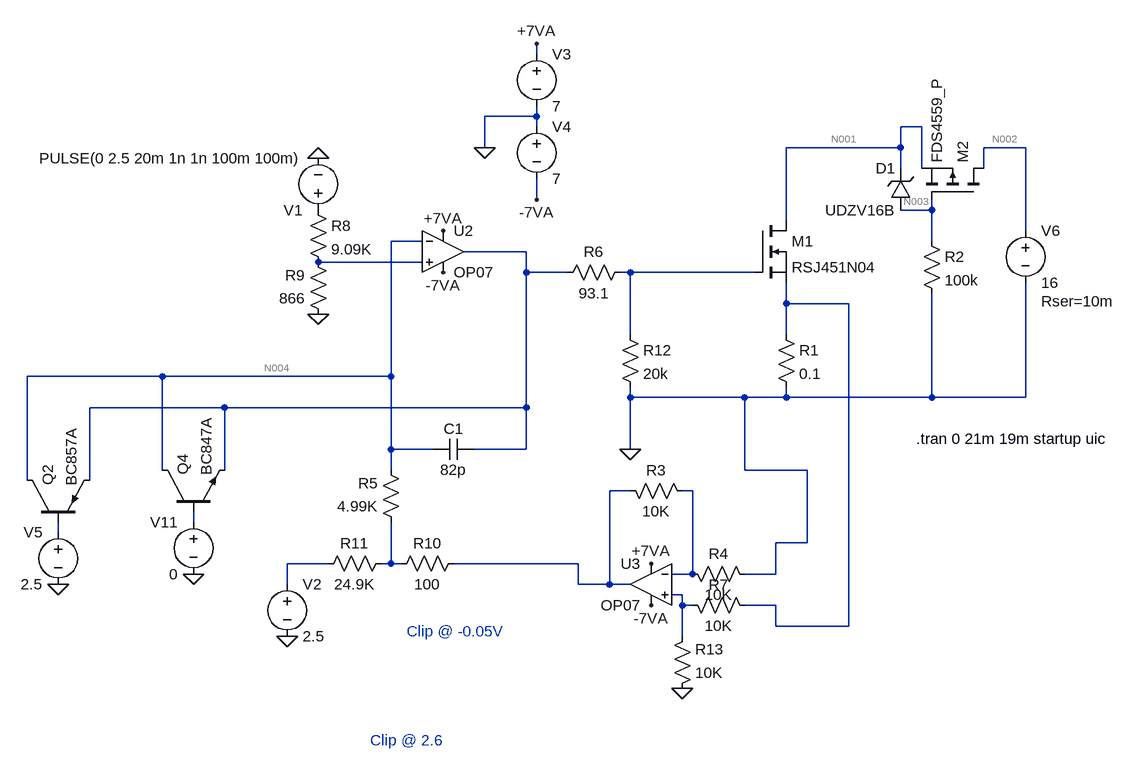
[diagram p0: schematic LOAD.asc]
LOAD.asc, the LTspice schematic file:
Version 4
SHEET 1 1792 1140
WIRE -272 -128 -272 -144
WIRE -272 -32 -272 -48
WIRE -272 -32 -352 -32
WIRE -272 -16 -272 -32
WIRE 320 -16 288 -16
WIRE -352 16 -352 -32
WIRE 288 16 288 -16
WIRE 288 16 112 16
WIRE 480 16 416 16
WIRE 288 48 288 16
WIRE 320 48 320 -16
WIRE 416 48 416 16
WIRE -272 96 -272 64
WIRE 336 112 336 96
WIRE 336 112 288 112
WIRE 112 128 112 16
WIRE 480 144 480 16
WIRE -448 160 -496 160
WIRE 336 160 336 112
WIRE -288 176 -384 176
WIRE -448 192 -608 192
WIRE -288 208 -288 176
WIRE -224 208 -288 208
WIRE -128 208 -144 208
WIRE 64 208 -128 208
WIRE 112 256 112 224
WIRE 208 256 112 256
WIRE -128 304 -128 208
WIRE 112 304 112 256
WIRE -848 368 -1056 368
WIRE -496 368 -496 160
WIRE -496 368 -848 368
WIRE -128 400 -128 384
WIRE 48 400 -128 400
WIRE 112 400 112 384
WIRE 112 400 48 400
WIRE 336 400 336 240
WIRE 336 400 112 400
WIRE 480 400 480 224
WIRE 480 400 336 400
WIRE -752 416 -960 416
WIRE -288 416 -288 208
WIRE -288 416 -752 416
WIRE -496 480 -496 368
WIRE -432 480 -496 480
WIRE -288 480 -288 416
WIRE -288 480 -368 480
WIRE -128 480 -128 400
WIRE -848 512 -848 368
WIRE -752 512 -752 416
WIRE -496 512 -496 480
WIRE 48 512 48 400
WIRE 144 512 48 512
WIRE -1056 528 -1056 368
WIRE -960 528 -960 416
WIRE -128 544 -160 544
WIRE -32 544 -48 544
WIRE -800 592 -800 576
WIRE -1008 608 -1008 592
WIRE 144 624 144 512
WIRE 144 624 96 624
WIRE -592 656 -656 656
WIRE -496 656 -496 592
WIRE -496 656 -512 656
WIRE -480 656 -496 656
WIRE -208 656 -400 656
WIRE -32 672 -32 544
WIRE -32 672 -64 672
WIRE 96 672 96 624
WIRE 96 672 48 672
WIRE -656 688 -656 656
WIRE -208 688 -208 656
WIRE -160 688 -160 544
WIRE -160 688 -208 688
WIRE -128 688 -160 688
WIRE -48 704 -64 704
WIRE -48 720 -48 704
WIRE -32 720 -48 720
WIRE 96 720 48 720
WIRE 96 752 96 720
WIRE 208 752 208 256
WIRE 208 752 96 752
WIRE -48 768 -48 720
FLAG -352 16 0
FLAG -608 32 0
FLAG -656 768 0
FLAG -608 272 0
FLAG -272 -144 +7VA
FLAG -272 96 -7VA
FLAG -416 144 +7VA
FLAG -416 208 -7VA
FLAG -1008 688 0
FLAG -800 672 0
FLAG -128 480 0
FLAG -96 656 +7VA
FLAG -96 720 -7VA
FLAG -48 848 0
SYMBOL nmos 64 128 R0
SYMATTR InstName M1
SYMATTR Value RSJ451N04
SYMBOL res 96 288 R0
SYMATTR InstName R1
SYMATTR Value 0.1
SYMBOL voltage -272 -144 R0
WINDOW 123 0 0 Left 2
WINDOW 39 0 0 Left 2
SYMATTR InstName V3
SYMATTR Value 7
SYMBOL voltage -272 -32 R0
WINDOW 123 0 0 Left 2
WINDOW 39 0 0 Left 2
SYMATTR InstName V4
SYMATTR Value 7
SYMBOL zener 304 112 R180
WINDOW 0 24 64 Left 2
WINDOW 3 24 0 Left 2
SYMATTR InstName D1
SYMATTR Value UDZV16B
SYMATTR Description Diode
SYMATTR Type diode
SYMBOL res 320 144 R0
SYMATTR InstName R2
SYMATTR Value 100k
SYMBOL pmos 416 96 M270
SYMATTR InstName M2
SYMATTR Value FDS4559_P
SYMBOL voltage 480 128 R0
WINDOW 123 0 0 Left 2
WINDOW 39 24 124 Left 2
SYMATTR SpiceLine Rser=10m
SYMATTR InstName V6
SYMATTR Value 16
SYMBOL res -128 192 R90
WINDOW 0 0 56 VBottom 2
WINDOW 3 32 56 VTop 2
SYMATTR InstName R6
SYMATTR Value 93.1
SYMBOL cap -368 464 R90
WINDOW 0 0 32 VBottom 2
WINDOW 3 32 32 VTop 2
SYMATTR InstName C1
SYMATTR Value 82p
SYMBOL voltage -608 128 R180
WINDOW 123 0 0 Left 2
WINDOW 39 0 0 Left 2
SYMATTR InstName V1
SYMATTR Value PULSE(0 2.5 20m 1n 1n 100m 100m)
SYMBOL res -624 96 R0
SYMATTR InstName R8
SYMATTR Value 9.09K
SYMBOL res -592 288 R180
WINDOW 0 36 76 Left 2
WINDOW 3 36 40 Left 2
SYMATTR InstName R9
SYMATTR Value 866
SYMBOL voltage -656 672 R0
WINDOW 123 0 0 Left 2
WINDOW 39 0 0 Left 2
SYMATTR InstName V2
SYMATTR Value 2.5
SYMBOL res -384 640 R90
WINDOW 0 0 56 VBottom 2
WINDOW 3 32 56 VTop 2
SYMATTR InstName R10
SYMATTR Value 100
SYMBOL res -496 640 R90
WINDOW 0 0 56 VBottom 2
WINDOW 3 32 56 VTop 2
SYMATTR InstName R11
SYMATTR Value 24.9K
SYMBOL res -144 288 R0
SYMATTR InstName R12
SYMATTR Value 20k
SYMBOL res -480 608 R180
WINDOW 0 36 76 Left 2
WINDOW 3 36 40 Left 2
SYMATTR InstName R5
SYMATTR Value 4.99K
SYMBOL pnp -1056 592 R270
SYMATTR InstName Q2
SYMATTR Value BC857A
SYMBOL voltage -1008 592 M0
WINDOW 123 0 0 Left 2
WINDOW 39 0 0 Left 2
SYMATTR InstName V5
SYMATTR Value 2.5
SYMBOL npn -848 576 R270
SYMATTR InstName Q4
SYMATTR Value BC847A
SYMBOL voltage -800 576 M0
WINDOW 123 0 0 Left 2
WINDOW 39 0 0 Left 2
SYMATTR InstName V11
SYMATTR Value 0
SYMBOL Opamps\\OP07 -416 112 R0
SYMATTR InstName U2
SYMBOL Opamps\\OP07 -96 624 M0
SYMATTR InstName U3
SYMBOL res -144 528 M90
WINDOW 0 0 56 VBottom 2
WINDOW 3 32 56 VTop 2
SYMATTR InstName R3
SYMATTR Value 10K
SYMBOL res -48 656 M90
WINDOW 0 0 56 VBottom 2
WINDOW 3 32 56 VTop 2
SYMATTR InstName R4
SYMATTR Value 10K
SYMBOL res -48 704 M90
WINDOW 0 0 56 VBottom 2
WINDOW 3 32 56 VTop 2
SYMATTR InstName R7
SYMATTR Value 10K
SYMBOL res -64 864 M180
WINDOW 0 36 76 Left 2
WINDOW 3 36 40 Left 2
SYMATTR InstName R13
SYMATTR Value 10K
TEXT 312 464 Left 2 !.tran 0 21m 19m startup uic
TEXT -472 760 Left 2 ;Clip @ -0.05V
TEXT -528 928 Left 2 ;Clip @ 2.6

The netlist it stands for:
* LOAD.asc
M1 N001 N007 N008 N008 RSJ451N04
R1 N008 0 0.1
V3 +7VA 0 7
V4 0 -7VA 7
D1 N003 N001 UDZV16B
R2 N003 0 100k
M2 N002 N003 N001 N001 FDS4559_P
V6 N002 0 16 Rser=10m
R6 N007 N005 93.1
C1 N005 N004 82p
V1 P001 0 PULSE(0 2.5 20m 1n 1n 100m 100m)
R8 P001 N006 9.09K
R9 0 N006 866
V2 N013 0 2.5
R10 N009 N014 100
R11 N014 N013 24.9K
R12 N007 0 20k
R5 N014 N004 4.99K
Q2 N004 N012 N005 0 BC857A
V5 N012 0 2.5
Q4 N004 N011 N005 0 BC847A
V11 N011 0 0
XU2 N006 N004 +7VA -7VA N005 LT1001  ; OP07, pins In+ In- V+ V- OUT
XU3 N015 N010 +7VA -7VA N009 LT1001  ; OP07, pins In+ In- V+ V- OUT
R3 N009 N010 10K
R4 N010 0 10K
R7 N015 N008 10K
R13 0 N015 10K
.model D D
.lib standard.dio
.model NPN NPN
.model PNP PNP
.lib standard.bjt
.model NMOS NMOS
.model PMOS PMOS
.lib standard.mos
.tran 0 21m 19m startup uic
* Clip @ -0.05V
* Clip @ 2.6
.lib LTC.lib
.backanno
.end

* Results of the author's LTspice run, read from the files saved beside the schematic
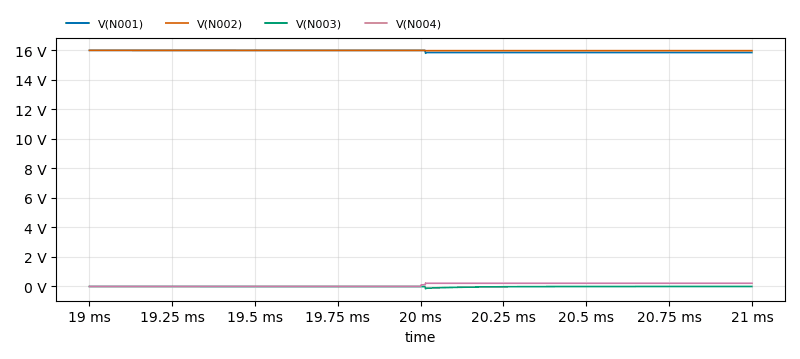
[diagram p1: Transient Analysis of LOAD.asc, plotted from the saved traces]
* Transient Analysis, 1 run:
*   V(N001): min 15.8 V, max 16 V, average 15.93 V, rms 15.93 V, last 15.85 V
*   V(N002): min 15.97 V, max 16 V, average 15.99 V, rms 15.99 V, last 15.98 V
*   V(N003): min -157.3 mV, max 18.31 µV, average -7.757 mV, rms 21.53 mV, last -59.7 µV
*   V(N004): min 659.5 nV, max 240.3 mV, average 108 mV, rms 153 mV, last 217.5 mV